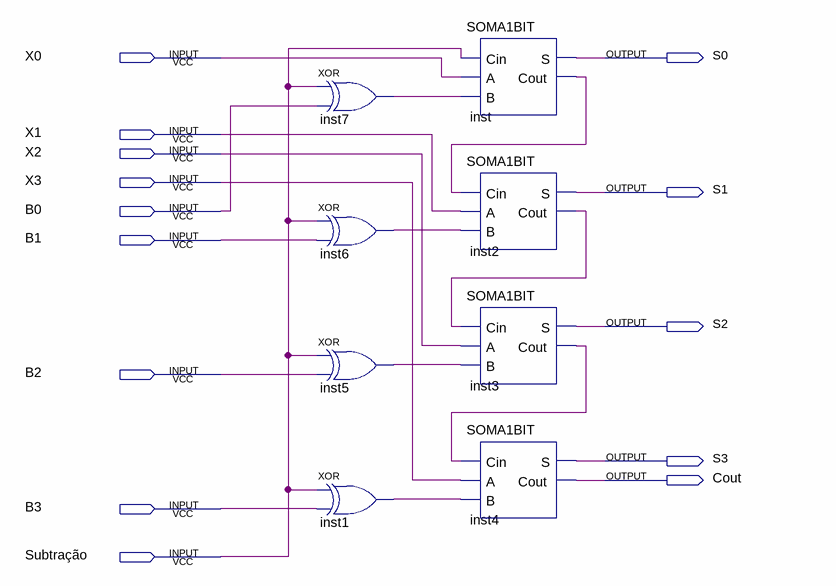
[diagram p0: schematic sheet]
// Quartus schematic SOMA4BITS.bdf as structural Verilog: 8 symbols, 14 pins
module SOMA4BITS (
  input  X0,
  input  X1,
  input  X2,
  input  X3,
  input  B0,
  input  B1,
  input  B2,
  input  B3,
  input  \Subtração ,
  output S0,
  output S1,
  output S2,
  output S3,
  output Cout
);

  wire inst1_out, inst2_cout, inst3_cout, inst5_out, inst6_out, inst7_out, inst_cout;

  xor inst7 (inst7_out, \Subtração , B0);
  xor inst6 (inst6_out, \Subtração , B1);
  xor inst5 (inst5_out, \Subtração , B2);
  xor inst1 (inst1_out, \Subtração , B3);
  SOMA1BIT inst (.Cin(\Subtração ), .A(X0), .B(inst7_out), .S(S0), .Cout(inst_cout));
  SOMA1BIT inst2 (.Cin(inst_cout), .A(X1), .B(inst6_out), .S(S1), .Cout(inst2_cout));
  SOMA1BIT inst3 (.Cin(inst2_cout), .A(X2), .B(inst5_out), .S(S2), .Cout(inst3_cout));
  SOMA1BIT inst4 (.Cin(inst3_cout), .A(X3), .B(inst1_out), .S(S3), .Cout(Cout));
endmodule
